# Altium project pressure-sensor-board.PrjPcb
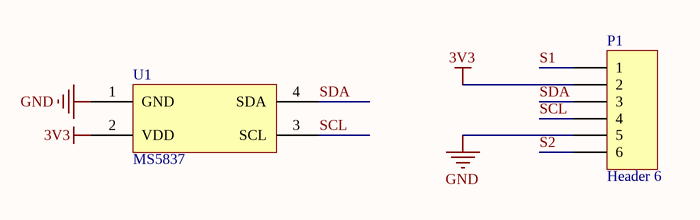
[diagram p0: pressure-sensor.SchDoc]
1 sheet, 2 parts. Net scope: global (net labels, ports and power ports of the same name join across sheets).
Board file: pressure-sensor.PcbDoc

## Sheet pressure-sensor.SchDoc
size A

### Parts
P1  Header 6  [HDR1X6]
U1  MS5837  [MS5837]

### Nets
3V3: P1.2 U1.2(VDD)
GND: P1.5 U1.1(GND)
S1: P1.1
S2: P1.6
SCL: P1.4 U1.3(SCL)
SDA: P1.3 U1.4(SDA)

### Library data of the parts
P1 = Header 6: Header, 6-Pin; LatestRevisionDate: 17-Jul-2002; LatestRevisionNote: Re-released for DXP Platform.; Publisher: Altium Limited
U1 = MS583730BA01-50: Manufacturer: TE Connectivity; Supplier 1: Farnell; Manufacturer Part Number: MS583730BA01-50; Stock 1: 723; Pricing 1: 1=28.45, 5=20.76, 10=18.74, 25=16.52, 50=15.21 (EUR); ComponentLink1URL: http://www.te.com/commerce/DocumentDelivery/DDEController?Action=srchrtrv&DocNm=MS5837-30BA&DocType=Data+Sheet&DocLang=English; ComponentLink1Description: http://www.te.com/commerce/DocumentDelivery/DDEController?Action=srchrtrv&DocNm=MS5837-30BA&DocType=Data+Sheet&DocLang=English